# Altium schematic sheet Power Test Pins.SchDoc: Power Test Pins
size A4
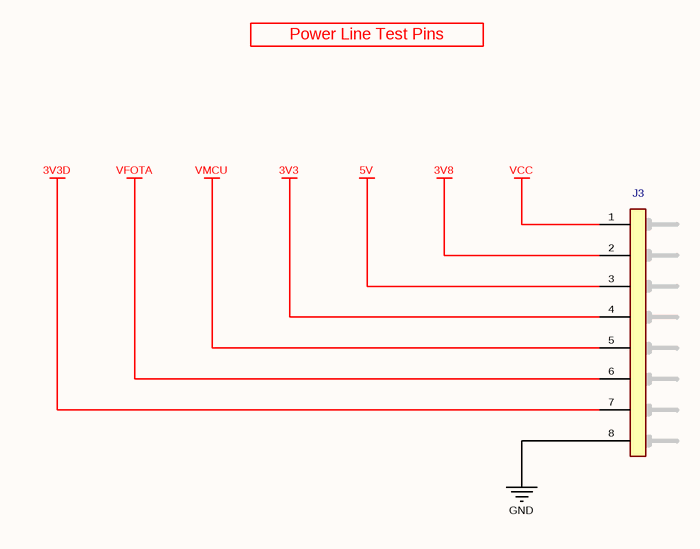
[diagram p0: Power Test Pins.SchDoc]

## Parts
J3  2.54 mm Pitch 8P Male Connector  [8P Header]  (value not drawn)

## Nets
3V3: J3.4(Pin-4)
3V3D: J3.7(Pin-7)
3V8: J3.2(Pin-2)
5V: J3.3(Pin-3)
GND: J3.8(Pin-8)
VCC: J3.1(Pin-1)
VFOTA: J3.6(Pin-6)
VMCU: J3.5(Pin-5)

## Notes on the sheet
- Power Line Test Pins
- Title
- Size:
- Date:
- A4
- Number:
- Time:
- Revision:
- Sheet
- of
- File:

## Library data of the parts
J3 = Connector - Male Header 8P (2.54): Headers & Wire Housings BREAKAWAY HDR VERT 8; Manufacturer Name: Molex; Position: 8; Row: 1; Pitch: 2.54 mm; Manufacturer Part Number: 22-28-4083; Mouser Part Number: 538-22-28-4083; ROHS: Yes; ComponentLink1Description: DataSheet; ComponentLink1URL: https://www.mouser.com.tr/datasheet/2/276/0022284063_PCB_HEADERS-228265.pdf; ComponentLink2Description: Mouser; ComponentLink2URL: https://www.mouser.com.tr/ProductDetail/Molex/22-28-4083/?qs=%2Fha2pyFaduguMWEp6M%252Bj0x6fHxUvnRGD%252BIxBoa6MO5w%3D